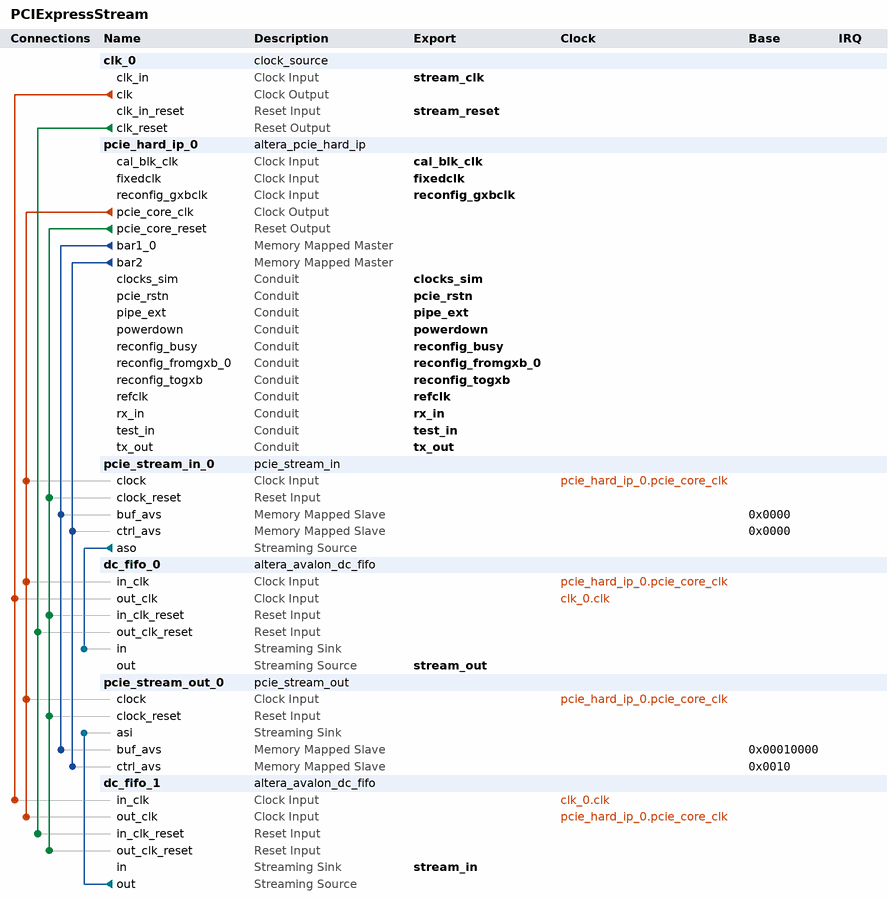
[diagram p0: system contents]
# Platform Designer (Qsys) system PCIExpressStream, Stratix IV EP4SGX230KF40C2
# Parameters at their usual value, and those the tool derives, are not listed.
package require -exact qsys 13.1
create_system PCIExpressStream
set_project_property DEVICE_FAMILY {Stratix IV}
set_project_property DEVICE EP4SGX230KF40C2

add_instance clk_0 clock_source 13.1
set_instance_parameter_value clk_0 clockFrequency 50000000

add_instance pcie_hard_ip_0 altera_pcie_hard_ip 13.1
set_instance_parameter_value pcie_hard_ip_0 max_link_width 4
set_instance_parameter_value pcie_hard_ip_0 p_pcie_test_out_width None
set_instance_parameter_value pcie_hard_ip_0 {BAR Type} {64 bit Prefetchable,Not used,32 bit Non-Prefetchable,Not used,Not used,Not used}
set_instance_parameter_value pcie_hard_ip_0 vendor_id 4466
set_instance_parameter_value pcie_hard_ip_0 device_id 3556
set_instance_parameter_value pcie_hard_ip_0 class_code 0
set_instance_parameter_value pcie_hard_ip_0 subsystem_vendor_id 4466
set_instance_parameter_value pcie_hard_ip_0 subsystem_device_id 4
set_instance_parameter_value pcie_hard_ip_0 my_advanced_errors false
set_instance_parameter_value pcie_hard_ip_0 my_enable_ecrc_check false
set_instance_parameter_value pcie_hard_ip_0 my_enable_ecrc_gen false
set_instance_parameter_value pcie_hard_ip_0 CB_PCIE_MODE 1
set_instance_parameter_value pcie_hard_ip_0 CG_IMPL_CRA_AV_SLAVE_PORT 0
set_instance_parameter_value pcie_hard_ip_0 CG_NO_CPL_REORDERING 0
set_instance_parameter_value pcie_hard_ip_0 CG_ENABLE_A2P_INTERRUPT 0
set_instance_parameter_value pcie_hard_ip_0 p_user_msi_enable 0
set_instance_parameter_value pcie_hard_ip_0 CB_A2P_ADDR_MAP_NUM_ENTRIES 2
set_instance_parameter_value pcie_hard_ip_0 CB_A2P_ADDR_MAP_PASS_THRU_BITS 20
set_instance_parameter_value pcie_hard_ip_0 {PCIe Address 63:32} 0x00000000,0x00000000,0x00000000,0x00000000,0x00000000,0x00000000,0x00000000,0x00000000,0x00000000,0x00000000,0x00000000,0x00000000,0x00000000,0x00000000,0x00000000,0x00000000
set_instance_parameter_value pcie_hard_ip_0 {PCIe Address 31:0} 0x00000000,0x00000000,0x00000000,0x00000000,0x00000000,0x00000000,0x00000000,0x00000000,0x00000000,0x00000000,0x00000000,0x00000000,0x00000000,0x00000000,0x00000000,0x00000000

add_instance pcie_stream_in_0 pcie_stream_in 1.0

add_instance dc_fifo_0 altera_avalon_dc_fifo 13.1
set_instance_parameter_value dc_fifo_0 BITS_PER_SYMBOL 8
set_instance_parameter_value dc_fifo_0 FIFO_DEPTH 16
set_instance_parameter_value dc_fifo_0 USE_PACKETS 0
set_instance_parameter_value dc_fifo_0 WR_SYNC_DEPTH 2
set_instance_parameter_value dc_fifo_0 RD_SYNC_DEPTH 2

add_instance pcie_stream_out_0 pcie_stream_out 1.0

add_instance dc_fifo_1 altera_avalon_dc_fifo 13.1
set_instance_parameter_value dc_fifo_1 BITS_PER_SYMBOL 8
set_instance_parameter_value dc_fifo_1 FIFO_DEPTH 16
set_instance_parameter_value dc_fifo_1 USE_PACKETS 0
set_instance_parameter_value dc_fifo_1 WR_SYNC_DEPTH 2
set_instance_parameter_value dc_fifo_1 RD_SYNC_DEPTH 2

# connections
add_connection clk_0.clk dc_fifo_0.out_clk clock
add_connection clk_0.clk dc_fifo_1.in_clk clock
add_connection pcie_hard_ip_0.pcie_core_clk dc_fifo_0.in_clk clock
add_connection pcie_hard_ip_0.pcie_core_clk dc_fifo_1.out_clk clock
add_connection pcie_hard_ip_0.pcie_core_clk pcie_stream_in_0.clock clock
add_connection pcie_hard_ip_0.pcie_core_clk pcie_stream_out_0.clock clock
add_connection clk_0.clk_reset dc_fifo_0.out_clk_reset reset
add_connection clk_0.clk_reset dc_fifo_1.in_clk_reset reset
add_connection pcie_hard_ip_0.pcie_core_reset dc_fifo_0.in_clk_reset reset
add_connection pcie_hard_ip_0.pcie_core_reset dc_fifo_1.out_clk_reset reset
add_connection pcie_hard_ip_0.pcie_core_reset pcie_stream_in_0.clock_reset reset
add_connection pcie_hard_ip_0.pcie_core_reset pcie_stream_out_0.clock_reset reset
add_connection pcie_hard_ip_0.bar1_0 pcie_stream_in_0.buf_avs avalon
set_connection_parameter_value pcie_hard_ip_0.bar1_0/pcie_stream_in_0.buf_avs baseAddress 0x0000
add_connection pcie_hard_ip_0.bar1_0 pcie_stream_out_0.buf_avs avalon
set_connection_parameter_value pcie_hard_ip_0.bar1_0/pcie_stream_out_0.buf_avs baseAddress 0x00010000
add_connection pcie_hard_ip_0.bar2 pcie_stream_in_0.ctrl_avs avalon
set_connection_parameter_value pcie_hard_ip_0.bar2/pcie_stream_in_0.ctrl_avs baseAddress 0x0000
add_connection pcie_hard_ip_0.bar2 pcie_stream_out_0.ctrl_avs avalon
set_connection_parameter_value pcie_hard_ip_0.bar2/pcie_stream_out_0.ctrl_avs baseAddress 0x0010
add_connection dc_fifo_1.out pcie_stream_out_0.asi avalon_streaming
add_connection pcie_stream_in_0.aso dc_fifo_0.in avalon_streaming

# exported interfaces
add_interface refclk conduit end
set_interface_property refclk EXPORT_OF pcie_hard_ip_0.refclk
add_interface test_in conduit end
set_interface_property test_in EXPORT_OF pcie_hard_ip_0.test_in
add_interface pcie_rstn conduit end
set_interface_property pcie_rstn EXPORT_OF pcie_hard_ip_0.pcie_rstn
add_interface clocks_sim conduit end
set_interface_property clocks_sim EXPORT_OF pcie_hard_ip_0.clocks_sim
add_interface reconfig_busy conduit end
set_interface_property reconfig_busy EXPORT_OF pcie_hard_ip_0.reconfig_busy
add_interface pipe_ext conduit end
set_interface_property pipe_ext EXPORT_OF pcie_hard_ip_0.pipe_ext
add_interface powerdown conduit end
set_interface_property powerdown EXPORT_OF pcie_hard_ip_0.powerdown
add_interface tx_out conduit end
set_interface_property tx_out EXPORT_OF pcie_hard_ip_0.tx_out
add_interface rx_in conduit end
set_interface_property rx_in EXPORT_OF pcie_hard_ip_0.rx_in
add_interface fixedclk clock sink
set_interface_property fixedclk EXPORT_OF pcie_hard_ip_0.fixedclk
add_interface stream_in avalon_streaming sink
set_interface_property stream_in EXPORT_OF dc_fifo_1.in
add_interface stream_out avalon_streaming source
set_interface_property stream_out EXPORT_OF dc_fifo_0.out
add_interface stream_clk clock sink
set_interface_property stream_clk EXPORT_OF clk_0.clk_in
add_interface stream_reset reset sink
set_interface_property stream_reset EXPORT_OF clk_0.clk_in_reset
add_interface reconfig_gxbclk clock sink
set_interface_property reconfig_gxbclk EXPORT_OF pcie_hard_ip_0.reconfig_gxbclk
add_interface reconfig_togxb conduit end
set_interface_property reconfig_togxb EXPORT_OF pcie_hard_ip_0.reconfig_togxb
add_interface reconfig_fromgxb_0 conduit end
set_interface_property reconfig_fromgxb_0 EXPORT_OF pcie_hard_ip_0.reconfig_fromgxb_0
add_interface cal_blk_clk clock sink
set_interface_property cal_blk_clk EXPORT_OF pcie_hard_ip_0.cal_blk_clk

set_interconnect_requirement {$system} qsys_mm.clockCrossingAdapter HANDSHAKE
set_interconnect_requirement {$system} qsys_mm.maxAdditionalLatency 1
set_interconnect_requirement {$system} qsys_mm.insertDefaultSlave false

save_system PCIExpressStream.qsys
